# Altium schematic sheet Versorgung.SchDoc: Netzteil
size A4; Date: 10.11.2025; Author: Alexander Schiechtl; Revision: v1.0; SheetNumber: 4; SheetTotal: 6; Project: 3D-Scanner
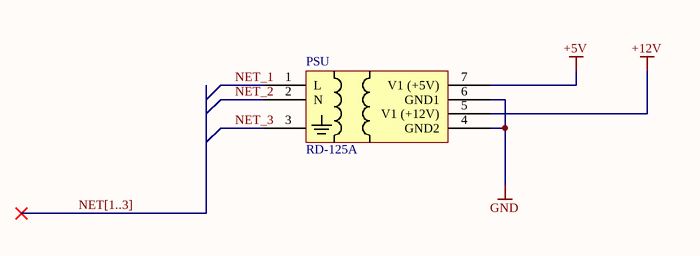
[diagram p0: Versorgung.SchDoc]

## Parts
PSU  RD-125A

## Nets
+5V: PSU.7(V1_(+5V))
+12V: PSU.5(V1_(+12V))
GND: PSU.4(GND2) PSU.6(GND1)
NET_1: PSU.1(L)
NET_2: PSU.2(N)
NET_3: PSU.3

## Buses and harness runs
bus NET[1..3]

## Notes on the sheet
- Project:
- Title:
- Leitner AG
- Zona Artigianale Est 7
- 39040 Racines BZ
- Italy
- Confidential
- Author:
- Document name:
- Date:
- Version:
- Size:
- A4

## Library data of the parts
PSU = PSU: MEAN WELL Schaltnetzteil, 5 V dc, 12 V dc / 7.7A 2-Kanal 130.9W 176 → 264 V ac, 248 → 373 V dc, 88